# Altium schematic sheet NUCLEOG431RB-Custom-IN-A2212.SchDoc: NUCLEOG431-Custom
size A4; Date: 8/26/2200; Author: Rahul; CompanyName: RVCE; DrawnBy: Rahul; Engineer: Rahul; Organization: RVCE; SheetNumber: 1; ENG_APP_DATE: --/--/--; DSN_APP_DATE: --/--/--; CHK_APP_DATE: --/--/--
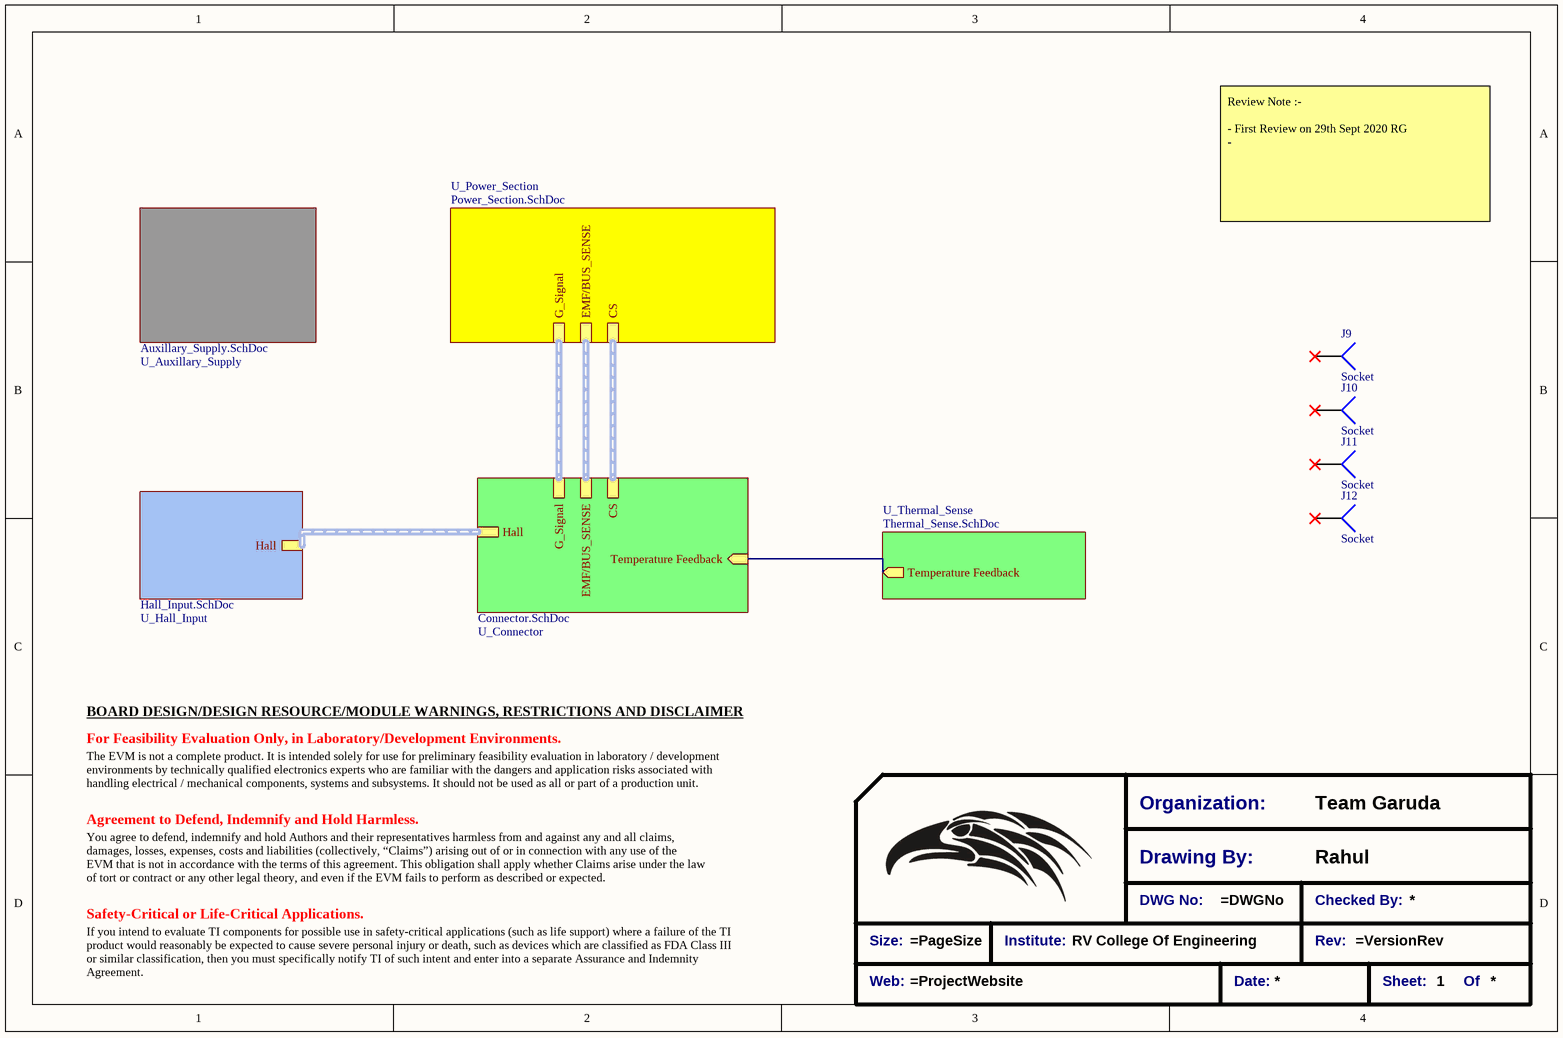
[diagram p0: NUCLEOG431RB-Custom-IN-A2212.SchDoc]

## Parts
*  Title_Block  (value not drawn)  (graphical)
J9  Socket  [Mounting_hole_3mm]
J10  Socket  [Mounting_hole_3mm]
J11  Socket  [Mounting_hole_3mm]
J12  Socket  [Mounting_hole_3mm]

## Sub-sheets
U_Auxillary_Supply = Auxillary_Supply.SchDoc: no entries
U_Connector = Connector.SchDoc: CS (harness CS), G_Signal (harness G_Signal), Temperature Feedback (in), Hall (harness Hall), EMF/BUS_SENSE (harness EMF/BUS_SENSE)
U_Hall_Input = Hall_Input.SchDoc: Hall (harness Hall)
U_Power_Section = Power_Section.SchDoc: G_Signal (harness G_Signal), CS (harness CS), EMF/BUS_SENSE (harness EMF/BUS_SENSE)
U_Thermal_Sense = Thermal_Sense.SchDoc: Temperature Feedback (out)

## Nets
(unnamed): sheet U_Connector/Temperature Feedback, sheet U_Thermal_Sense/Temperature Feedback

Not connected (* = marked no-connect by the designer): J9 1*; J10 1*; J11 1*; J12 1*

## Buses and harness runs
harness sheet U_Connector/CS = sheet U_Power_Section/CS
harness sheet U_Connector/EMF/BUS_SENSE = sheet U_Power_Section/EMF/BUS_SENSE
harness sheet U_Connector/G_Signal = sheet U_Power_Section/G_Signal
harness sheet U_Connector/Hall = sheet U_Hall_Input/Hall

## Notes on the sheet
- Review Note :-
  - First Review on 29th Sept 2020 RG
  -
- BOARD DESIGN/DESIGN RESOURCE/MODULE WARNINGS, RESTRICTIONS AND DISCLAIMER
- For Feasibility Evaluation Only, in Laboratory/Development Environments.
- The EVM is not a complete product. It is intended solely for use for preliminary feasibility evaluation in laboratory / development environments by technically qualified electronics experts who are familiar with the dangers and application risks associated with handling electrical / mechanical components, systems and subsystems. It should not be used as all or part of a production unit.
- Agreement to Defend, Indemnify and Hold Harmless.
- You agree to defend, indemnify and hold Authors and their representatives harmless from and against any and all claims, damages, losses, expenses, costs and liabilities (collectively, “Claims”) arising out of or in connection with any use of the
  EVM that is not in accordance with the terms of this agreement. This obligation shall apply whether Claims arise under the law of tort or contract or any other legal theory, and even if the EVM fails to perform as described or expected.
- Safety-Critical or Life-Critical Applications.
- If you intend to evaluate TI components for possible use in safety-critical applications (such as life support) where a failure of the TI product would reasonably be expected to cause severe personal injury or death, such as devices which are classified as FDA Class III or similar classification, then you must specifically notify TI of such intent and enter into a separate Assurance and Indemnity Agreement.
- Title
- Size:
- Date:
- A3
- Number:
- Time:
- Revision:
- Sheet
- of
- File:
- (in symbol Title_Block) Organization:; Team Garuda; Drawing By:; DWG No:; Checked By:; Size:; Institute:; RV College Of Engineering; Rev:; Web:; Date:; Sheet:; Of

## Library data of the parts
* = Title_Block: Standard Title Block
J9-J12 = Socket: LatestRevisionDate: 17-Jul-2002; LatestRevisionNote: Re-released for DXP Platform.; Publisher: Altium Limited